# Altium project DC Switch Matrix.PrjPcb
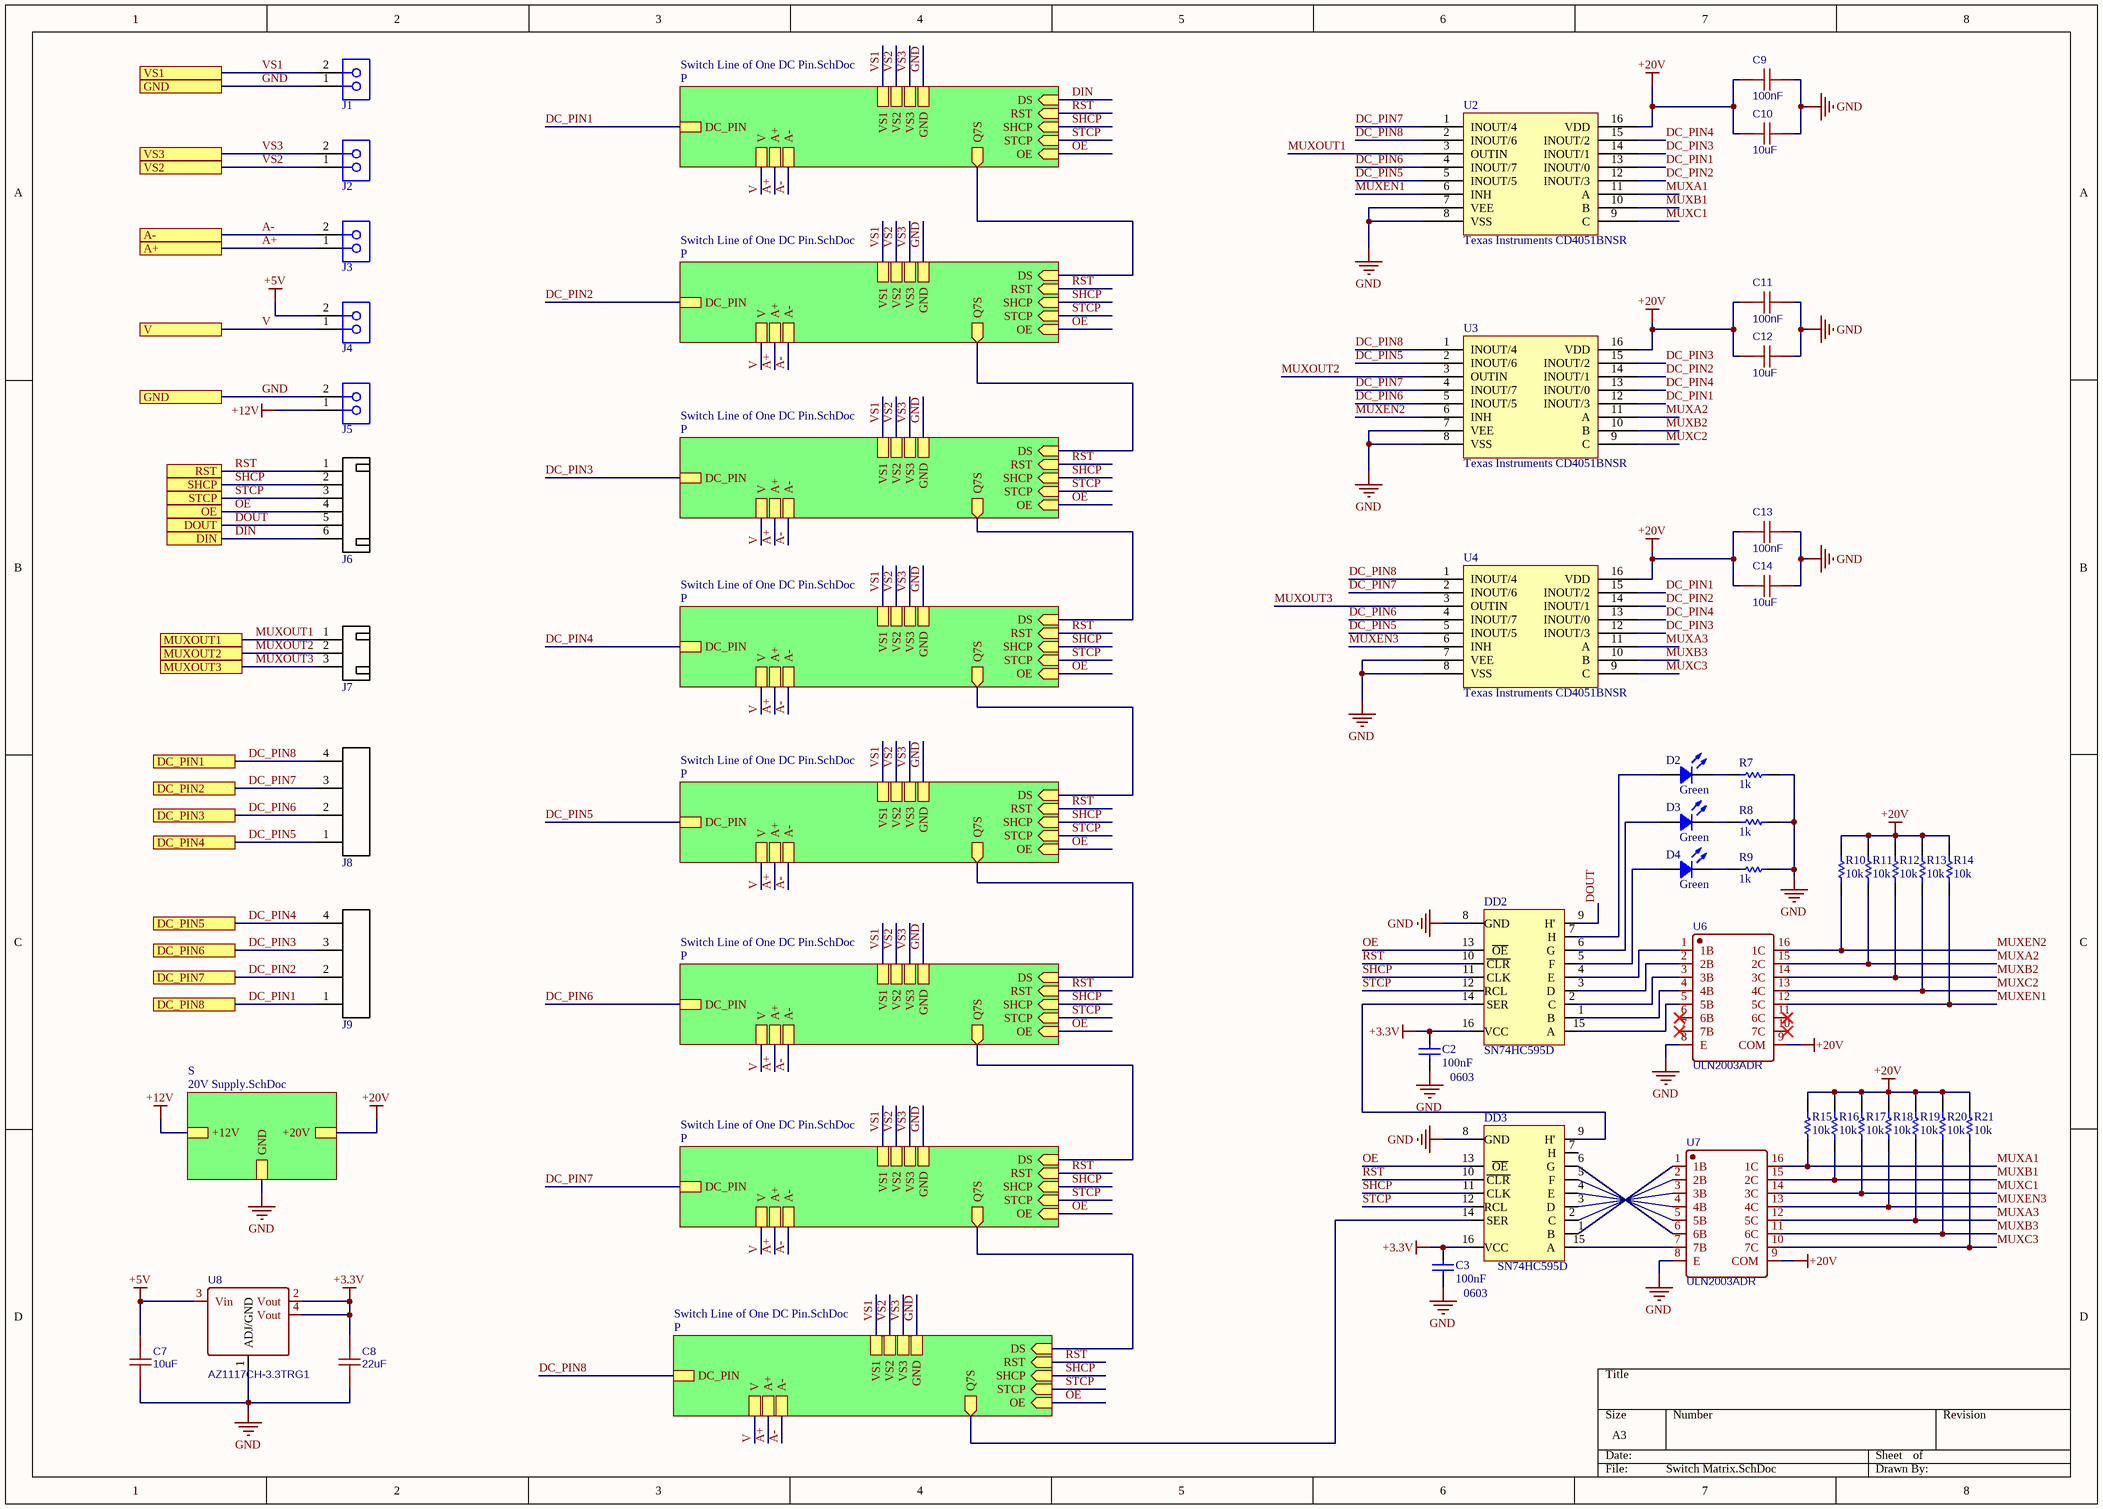
[diagram p0: Switch Matrix.SchDoc]
3 sheets, 174 parts. Net scope: hierarchical (ports join the sheet entries above them; power ports are global).
Board file: Switch Matrix PCB.PcbDoc
Sheets:
  Switch Matrix.SchDoc
    P = Switch Line of One DC Pin.SchDoc
    P = Switch Line of One DC Pin.SchDoc
    P = Switch Line of One DC Pin.SchDoc
    P = Switch Line of One DC Pin.SchDoc
    P = Switch Line of One DC Pin.SchDoc
    P = Switch Line of One DC Pin.SchDoc
    P = Switch Line of One DC Pin.SchDoc
    P = Switch Line of One DC Pin.SchDoc
    S = 20V Supply.SchDoc

## Sheet Switch Matrix.SchDoc
size A3

### Parts
C2  100nF  Package / Case: 0603  [CAPC1608X09N]
C3  100nF  Package / Case: 0603  [CAPC1608X09N]
C7  10uF  [C0805]
C8  22uF  [C0603]
C9  100nF  [C0603]
C10  10uF  [C0805]
C11  100nF  [C0603]
C12  10uF  [C0805]
C13  100nF  [C0603]
C14  10uF  [C0805]
D2  Green  [LED 0603_1608 GREEN]
D3  Green  [LED 0603_1608 GREEN]
D4  Green  [LED 0603_1608 GREEN]
DD2  SN74HC595D  [PCB-72k1vk0k27b6qyyenbg0-1]
DD3  SN74HC595D  [PCB-72k1vk0k27b6qyyenbg0-1]
J1  DB126V-5.0-2P-GN  [PCB-kiok1jlp9o9fcwf1wwvf-1]  (value not drawn)
J2  DB126V-5.0-2P-GN  [PCB-kiok1jlp9o9fcwf1wwvf-1]  (value not drawn)
J3  DB126V-5.0-2P-GN  [PCB-kiok1jlp9o9fcwf1wwvf-1]  (value not drawn)
J4  DB126V-5.0-2P-GN  [PCB-kiok1jlp9o9fcwf1wwvf-1]  (value not drawn)
J5  DB126V-5.0-2P-GN  [PCB-kiok1jlp9o9fcwf1wwvf-1]  (value not drawn)
J6  JST S6B-XH-A  [JST S6B-XH-A]  (value not drawn)
J7  CN-1P-M-R3  [JST-S3B-XH-A(LF)(SN)_V]  (value not drawn)
J8  JST B4PS-VH(LF)(SN)  [PCB-fv0n1qe7e7tw0owzte2c-1]  (value not drawn)
J9  JST B4PS-VH(LF)(SN)  [PCB-fv0n1qe7e7tw0owzte2c-1]  (value not drawn)
R7  1k  [gen0603-2]
R8  1k  [gen0603-2]
R9  1k  [gen0603-2]
R10  10k  [gen0603-2]
R11  10k  [gen0603-2]
R12  10k  [gen0603-2]
R13  10k  [gen0603-2]
R14  10k  [gen0603-2]
R15  10k  [gen0603-2]
R16  10k  [gen0603-2]
R17  10k  [gen0603-2]
R18  10k  [gen0603-2]
R19  10k  [gen0603-2]
R20  10k  [gen0603-2]
R21  10k  [gen0603-2]
U2  Texas Instruments CD4051BNSR  [PCB-xp4qbii5l2bbflfsgoli-1]
U3  Texas Instruments CD4051BNSR  [PCB-xp4qbii5l2bbflfsgoli-1]
U4  Texas Instruments CD4051BNSR  [PCB-xp4qbii5l2bbflfsgoli-1]
U6  ULN2003ADR  [SOIC-16_L9.9-W3.9-P1.27-LS6.0-BL]
U7  ULN2003ADR  [SOIC-16_L9.9-W3.9-P1.27-LS6.0-BL]
U8  AZ1117CH-3.3TRG1  [SOT-223-3_L6.5-W3.4-P2.30-LS7.0-BR]

### Sub-sheets
P = Switch Line of One DC Pin.SchDoc: DC_PIN, STCP (in), SHCP (in), Q7S (out), VS2, OE (in), VS1, RST (in), VS3, DS (in), GND, A+, A-, V
P = Switch Line of One DC Pin.SchDoc: DC_PIN, STCP (in), SHCP (in), Q7S (out), VS2, OE (in), VS1, RST (in), VS3, DS (in), GND, A+, A-, V
P = Switch Line of One DC Pin.SchDoc: DC_PIN, STCP (in), SHCP (in), Q7S (out), VS2, OE (in), VS1, RST (in), VS3, DS (in), GND, A+, A-, V
P = Switch Line of One DC Pin.SchDoc: DC_PIN, STCP (in), SHCP (in), Q7S (out), VS2, OE (in), VS1, RST (in), VS3, DS (in), GND, A+, A-, V
P = Switch Line of One DC Pin.SchDoc: DC_PIN, STCP (in), SHCP (in), Q7S (out), VS2, OE (in), VS1, RST (in), VS3, DS (in), GND, A+, A-, V
P = Switch Line of One DC Pin.SchDoc: DC_PIN, STCP (in), SHCP (in), Q7S (out), VS2, OE (in), VS1, RST (in), VS3, DS (in), GND, A+, A-, V
P = Switch Line of One DC Pin.SchDoc: DC_PIN, STCP (in), SHCP (in), Q7S (out), VS2, OE (in), VS1, RST (in), VS3, DS (in), GND, A+, A-, V
P = Switch Line of One DC Pin.SchDoc: DC_PIN, STCP (in), SHCP (in), Q7S (out), VS2, OE (in), VS1, RST (in), VS3, DS (in), GND, A+, A-, V
S = 20V Supply.SchDoc: +20V, +12V, GND

### Ports
A+, A-, DC_PIN1, DC_PIN2, DC_PIN3, DC_PIN4, DC_PIN5, DC_PIN6, DC_PIN7, DC_PIN8, DIN, DOUT, GND, MUXOUT1, MUXOUT2, MUXOUT3, OE, RST, SHCP, STCP, V, VS1, VS2, VS3

### Nets
+3.3V: C2.2 C3.2 C8.2 DD2.16(VCC) DD3.16(VCC) U8.2(Vout) U8.4(Vout)
+5V: C7.2 J4.2 U8.3(Vin)
+12V: J5.1 ; sheet S/+12V
+20V: C9.1 C10.2 C11.1 C12.2 C13.1 C14.2 R10.2 R11.2 R12.2 R13.2 R14.2 R15.2 R16.2 R17.2 R18.2 R19.2 R20.2 R21.2 U2.16(VDD) U3.16(VDD) U4.16(VDD) U6.9(COM) U7.9(COM) ; sheet S/+20V
GND: C2.1 C3.1 C7.1 C8.1 C9.2 C10.1 C11.2 C12.1 C13.2 C14.1 DD2.8(GND) DD3.8(GND) J1.1 J5.2 R7.1 R8.1 R9.1 U2.7(VEE) U2.8(VSS) U3.7(VEE) U3.8(VSS) U4.7(VEE) U4.8(VSS) U6.8(E) U7.8(E) U8.1(ADJ/GND) ; port GND, sheet P/GND, sheet P/GND, sheet P/GND, sheet P/GND, sheet P/GND, sheet P/GND, sheet P/GND, sheet P/GND, sheet S/GND
A+: J3.1 ; port A+, sheet P/A+, sheet P/A+, sheet P/A+, sheet P/A+, sheet P/A+, sheet P/A+, sheet P/A+, sheet P/A+
A-: J3.2 ; port A-, sheet P/A-, sheet P/A-, sheet P/A-, sheet P/A-, sheet P/A-, sheet P/A-, sheet P/A-, sheet P/A-
DC_PIN1: J9.1 U2.13(INOUT/0) U3.12(INOUT/3) U4.15(INOUT/2) ; port DC_PIN8, sheet P/DC_PIN
DC_PIN2: J9.2 U2.12(INOUT/3) U3.14(INOUT/1) U4.14(INOUT/1) ; port DC_PIN7, sheet P/DC_PIN
DC_PIN3: J9.3 U2.14(INOUT/1) U3.15(INOUT/2) U4.12(INOUT/3) ; port DC_PIN6, sheet P/DC_PIN
DC_PIN4: J9.4 U2.15(INOUT/2) U3.13(INOUT/0) U4.13(INOUT/0) ; port DC_PIN5, sheet P/DC_PIN
DC_PIN5: J8.1 U2.5(INOUT/5) U3.2(INOUT/6) U4.5(INOUT/5) ; port DC_PIN4, sheet P/DC_PIN
DC_PIN6: J8.2 U2.4(INOUT/7) U3.5(INOUT/5) U4.4(INOUT/7) ; port DC_PIN3, sheet P/DC_PIN
DC_PIN7: J8.3 U2.1(INOUT/4) U3.4(INOUT/7) U4.2(INOUT/6) ; port DC_PIN2, sheet P/DC_PIN
DC_PIN8: J8.4 U2.2(INOUT/6) U3.1(INOUT/4) U4.1(INOUT/4) ; port DC_PIN1, sheet P/DC_PIN
DIN: J6.6 ; port DIN, sheet P/DS
DOUT: DD2.9(H') J6.5 ; port DOUT
MUXA1: R15.1 U2.11(A) U7.16(1C)
MUXA2: R11.1 U3.11(A) U6.15(2C)
MUXA3: R19.1 U4.11(A) U7.12(5C)
MUXB1: R16.1 U2.10(B) U7.15(2C)
MUXB2: R12.1 U3.10(B) U6.14(3C)
MUXB3: R20.1 U4.10(B) U7.11(6C)
MUXC1: R17.1 U2.9(C) U7.14(3C)
MUXC2: R13.1 U3.9(C) U6.13(4C)
MUXC3: R21.1 U4.9(C) U7.10(7C)
MUXEN1: R14.1 U2.6(INH) U6.12(5C)
MUXEN2: R10.1 U3.6(INH) U6.16(1C)
MUXEN3: R18.1 U4.6(INH) U7.13(4C)
MUXOUT1: J7.1 U2.3(OUTIN) ; port MUXOUT1
MUXOUT2: J7.2 U3.3(OUTIN) ; port MUXOUT2
MUXOUT3: J7.3 U4.3(OUTIN) ; port MUXOUT3
OE: DD2.13(~{OE}) DD3.13(~{OE}) J6.4 ; port OE, sheet P/OE, sheet P/OE, sheet P/OE, sheet P/OE, sheet P/OE, sheet P/OE, sheet P/OE, sheet P/OE
RST: DD2.10(~{CLR}) DD3.10(~{CLR}) J6.1 ; port RST, sheet P/RST, sheet P/RST, sheet P/RST, sheet P/RST, sheet P/RST, sheet P/RST, sheet P/RST, sheet P/RST
SHCP: DD2.11(CLK) DD3.11(CLK) J6.2 ; port SHCP, sheet P/SHCP, sheet P/SHCP, sheet P/SHCP, sheet P/SHCP, sheet P/SHCP, sheet P/SHCP, sheet P/SHCP, sheet P/SHCP
STCP: DD2.12(RCL) DD3.12(RCL) J6.3 ; port STCP, sheet P/STCP, sheet P/STCP, sheet P/STCP, sheet P/STCP, sheet P/STCP, sheet P/STCP, sheet P/STCP, sheet P/STCP
V: J4.1 ; port V, sheet P/V, sheet P/V, sheet P/V, sheet P/V, sheet P/V, sheet P/V, sheet P/V, sheet P/V
VS1: J1.2 ; port VS1, sheet P/VS1, sheet P/VS1, sheet P/VS1, sheet P/VS1, sheet P/VS1, sheet P/VS1, sheet P/VS1, sheet P/VS1
VS2: J2.1 ; port VS2, sheet P/VS2, sheet P/VS2, sheet P/VS2, sheet P/VS2, sheet P/VS2, sheet P/VS2, sheet P/VS2, sheet P/VS2
VS3: J2.2 ; port VS3, sheet P/VS3, sheet P/VS3, sheet P/VS3, sheet P/VS3, sheet P/VS3, sheet P/VS3, sheet P/VS3, sheet P/VS3
NetD2_1: D2.1 DD2.7(H)
NetD2_2: D2.2 R7.2
NetD3_1: D3.1 DD2.6(G)
NetD3_2: D3.2 R8.2
NetD4_1: D4.1 DD2.5(F)
NetD4_2: D4.2 R9.2
NetDD1_P1_9: sheet P/DS, sheet P/Q7S
NetDD1_P2_9: sheet P/DS, sheet P/Q7S
NetDD1_P3_9: sheet P/DS, sheet P/Q7S
NetDD1_P4_9: sheet P/DS, sheet P/Q7S
NetDD1_P5_9: sheet P/DS, sheet P/Q7S
NetDD1_P6_9: sheet P/DS, sheet P/Q7S
NetDD1_P7_9: sheet P/DS, sheet P/Q7S
NetDD1_P8_9: DD3.14(SER) ; sheet P/Q7S
NetDD2_1: DD2.1(B) U6.4(4B)
NetDD2_2: DD2.2(C) U6.3(3B)
NetDD2_3: DD2.3(D) U6.2(2B)
NetDD2_4: DD2.4(E) U6.1(1B)
NetDD2_14: DD2.14(SER) DD3.9(H')
NetDD2_15: DD2.15(A) U6.5(5B)
NetDD3_1: DD3.1(B) U7.1(1B)
NetDD3_2: DD3.2(C) U7.2(2B)
NetDD3_3: DD3.3(D) U7.3(3B)
NetDD3_4: DD3.4(E) U7.4(4B)
NetDD3_5: DD3.5(F) U7.5(5B)
NetDD3_6: DD3.6(G) U7.6(6B)
NetDD3_15: DD3.15(A) U7.7(7B)

Not connected (* = marked no-connect by the designer): DD3 7(H); U6 6(6B)* 7(7B)* 10(7C)* 11(6C)*

### Library data of the parts
C2 C3 = CMP-2f55e5122ad9f092-5: 0603 10 nF 50 V ± 10% Tolerance X7R Surface Mount Multilayer Ceramic Capacitor; Manufacture Part Number: CC0603KRX7R9BB104; Manufacturer: YAGEO; Voltage-Rated: 50V; Capacitance Tolerance: 10%; Capacitance: 100nF; Supplier: LCSC; Supplier Part Number: C14663
C7 C10 C12 C14 = 10uF: Manufacture Part Number: CL21B106KOQNNNE; Manufacturer: SAMSUNG; nameAlias: Capacitance; spicePre: C; spiceSymbolName: CL21B106KOQNNNE; Supplier: LCSC; Supplier Part Number: C95841
C8 = 22uF: Manufacture Part Number: CL10A226MP8NUNE; Manufacturer: SAMSUNG; nameAlias: Capacitance; SMT Type: Extend; BOM_LCSC Assembly: Yes; spicePre: C; spiceSymbolName: CL10A226MP8NUNE; Supplier: LCSC; Supplier Part Number: C86295
C9 C11 C13 = 100nF: Manufacture Part Number: CC0603KRX7R9BB104; Manufacturer: YAGEO; nameAlias: Capacitance; SMT Type: Basic; BOM_LCSC Assembly: Yes; spicePre: C; spiceSymbolName: CC0603KRX7R9BB104; Supplier: LCSC; Supplier Part Number: C14663
D2-D4 = TLMG1100-GS08: LED GREEN 0603 SMD; Manufacturer: Orient; Manufacture Part Number: ORH-G36G; Forward Voltage: 2.8V; Color: Green; ComponentLink1Description: Datasheet; ComponentLink1URL: http://www.vishay.com/docs/83173/tlmb1100.pdf; ComponentLink2Description: DigiKey Link; ComponentLink2URL: http://digikey.com/product-detail/en/vishay-semiconductor-opto-division/TLMG1100-GS08/751-1165-1-ND/1681448; Supplier: LCSC; Supplier Part Number: C205443
DD2 DD3 = CMP-ded317d957220114-5: Shift Register Single 8-Bit Serial to Serial/Parallel 16-Pin SOIC Tube; Manufacture Part Number: 74HC595D,118; Manufacturer: Nexperia; Supplier: LCSC; Supplier Part Number: C5947; Package / Case: SOIC-16_150mil
J1-J5 = CMP-7ad9b3d37ed8a51e-5: Block, Terminal; 13.5 A; 250 V; 5 mm; 26 to 16 AWG; 2; Screw; Solder; 4 kV; PA; Manufacturer: DIBO; Pin pitch: 5.0mm; Manufacture Part Number: DB126V-5.0-2P-GN; Supplier: LCSC; Supplier Part Number: C395849
J6 = CMP-239aeae271c2fc5d-12: Socket; wire-board; male; PIN: 6; 2.5mm; THT; XH; 250V; 3A; -25÷85°C; Manufacturer: JST Sales America; Manufacture Part Number: S6B-XH-A(LF)(SN); Lead-Free Status: Lead Free; Voltage Rating (AC): 250 V; Orientation: Right Angle; Supplier: LCSC; Supplier Part Number: C157919
J7 = CMP-656568-19: Male Header, Pitch 2.5 mm, 1 x 3 Position, Height 6.1 mm, Tail Length 3.4 mm, -25 to 85 degC, RoHS, Bulk; Manufacture Part Number: S3B-XH-A(LF)(SN); Manufacturer: JST Sales America; Number of Contacts: 3; Current Rating: 3.00 A; Lead-Free Status: Lead Free; Insulation Resistance: 1.00 GΩ; RoHS: Compliant; PackageDescription: Male Header, Pitch 2.5 mm, 1 x 3 Position, Height 6.1 mm, Tail Length 3.4 mm; Gender: Male; Mounting Style: Through Hole; PackageReference: S3B-XH-A(LF)(SN); Supplier Part Number: C157928; Supplier: LCSC
J8 J9 = CMP-324efb47dcc6ed89-6: Connector Header, VH Series, 4 Position, 3.96mm, 250V, 22-16 AWG, Side Entry, Natural; Manufacture Part Number: B8PS-VH(LF)(SN); Manufacturer: JST Sales America; Current Rating: 7.00 A; Pin Pitch: 3.96 mm; Supplier: LCSC; Supplier Part Number: C157970
R7-R9 = CMP-1853278-27: Manufacture Part Number: RC0603FR-071KL; Manufacturer: YAGEO; Resistance Tolerance: 1%; Supplier: LCSC; Supplier Part Number: C22548; Resistance: 1k; Package / Case: 0603
R10-R21 = CMP-1853278-27: Manufacture Part Number: RC0603FR-0710KL; Manufacturer: YAGEO; Resistance Tolerance: 1%; Supplier: LCSC; Supplier Part Number: C98220; Resistance: 10k; Package / Case: 0603
U2-U4 = CMP-7a8fb3826b5da548-1: 20-V, 8: 1, 1-channel analog multiplexer with logic-level conversion 16-SO -55 to 125; Bandwidth: 20.0 MHz; Lead-Free Status: Lead Free; Number of Bits: 8; Number of Circuits: 1; Polarity: Non-Inverting; Propagation Delay Max (tpd): 20.0 ns; Quiescent Current: 80.0 nA; Supply Current: 100 µA; Supply Voltage (DC): 15.0 V; Voltage Nodes: 10.0 V, 5.00 V, 15.0 V; Octopart URL: https://octopart.com/cd4051bnsr-texas+instruments-472244; Case/Package: PDIP, SOIC, SOP; Lifecycle Status: Active; Mounting Style: Surface Mount; Number of Channels: 8; Operating Temperature: -55.0 °C to 125 °C; Packaging: SOIC-16_208mil; Number of Pins: 16; RoHS: Compliant; OctopartID: 7a8fb3826b5da548; Supplier Part Number: C87646; Supplier: LCSC; Manufacture Part Number: CD4051BNSR; Manufacturer: Texas Instruments
U6 U7 = ULN2003ADR: Manufacturer: TI; SMT Type: Basic; spicePre: X; image: //image.lceda.cn/szlcsc/C7512.jpg; BOM_LCSC Assembly: Yes; spiceSymbolName: ULN2003ADR; Manufacture Part Number: ULN2003ADR; Supplier: LCSC; Supplier Part Number: C7512
U8 = AZ1117CH-3.3TRG1: Manufacturer: DIODES; SMT Type: Extend; BOM_LCSC Assembly: Yes; spicePre: U; spiceSymbolName: AZ1117CH-3.3TRG1; Manufacture Part Number: AZ1117CH-3.3TRG1; Supplier: LCSC; Supplier Part Number: C92102

## Sheet Switch Line of One DC Pin.SchDoc
size A3
Used 8 times, as channels P, P, P, P, P, P, P, P. Parts and nets are listed once, with the designators drawn on the sheet.
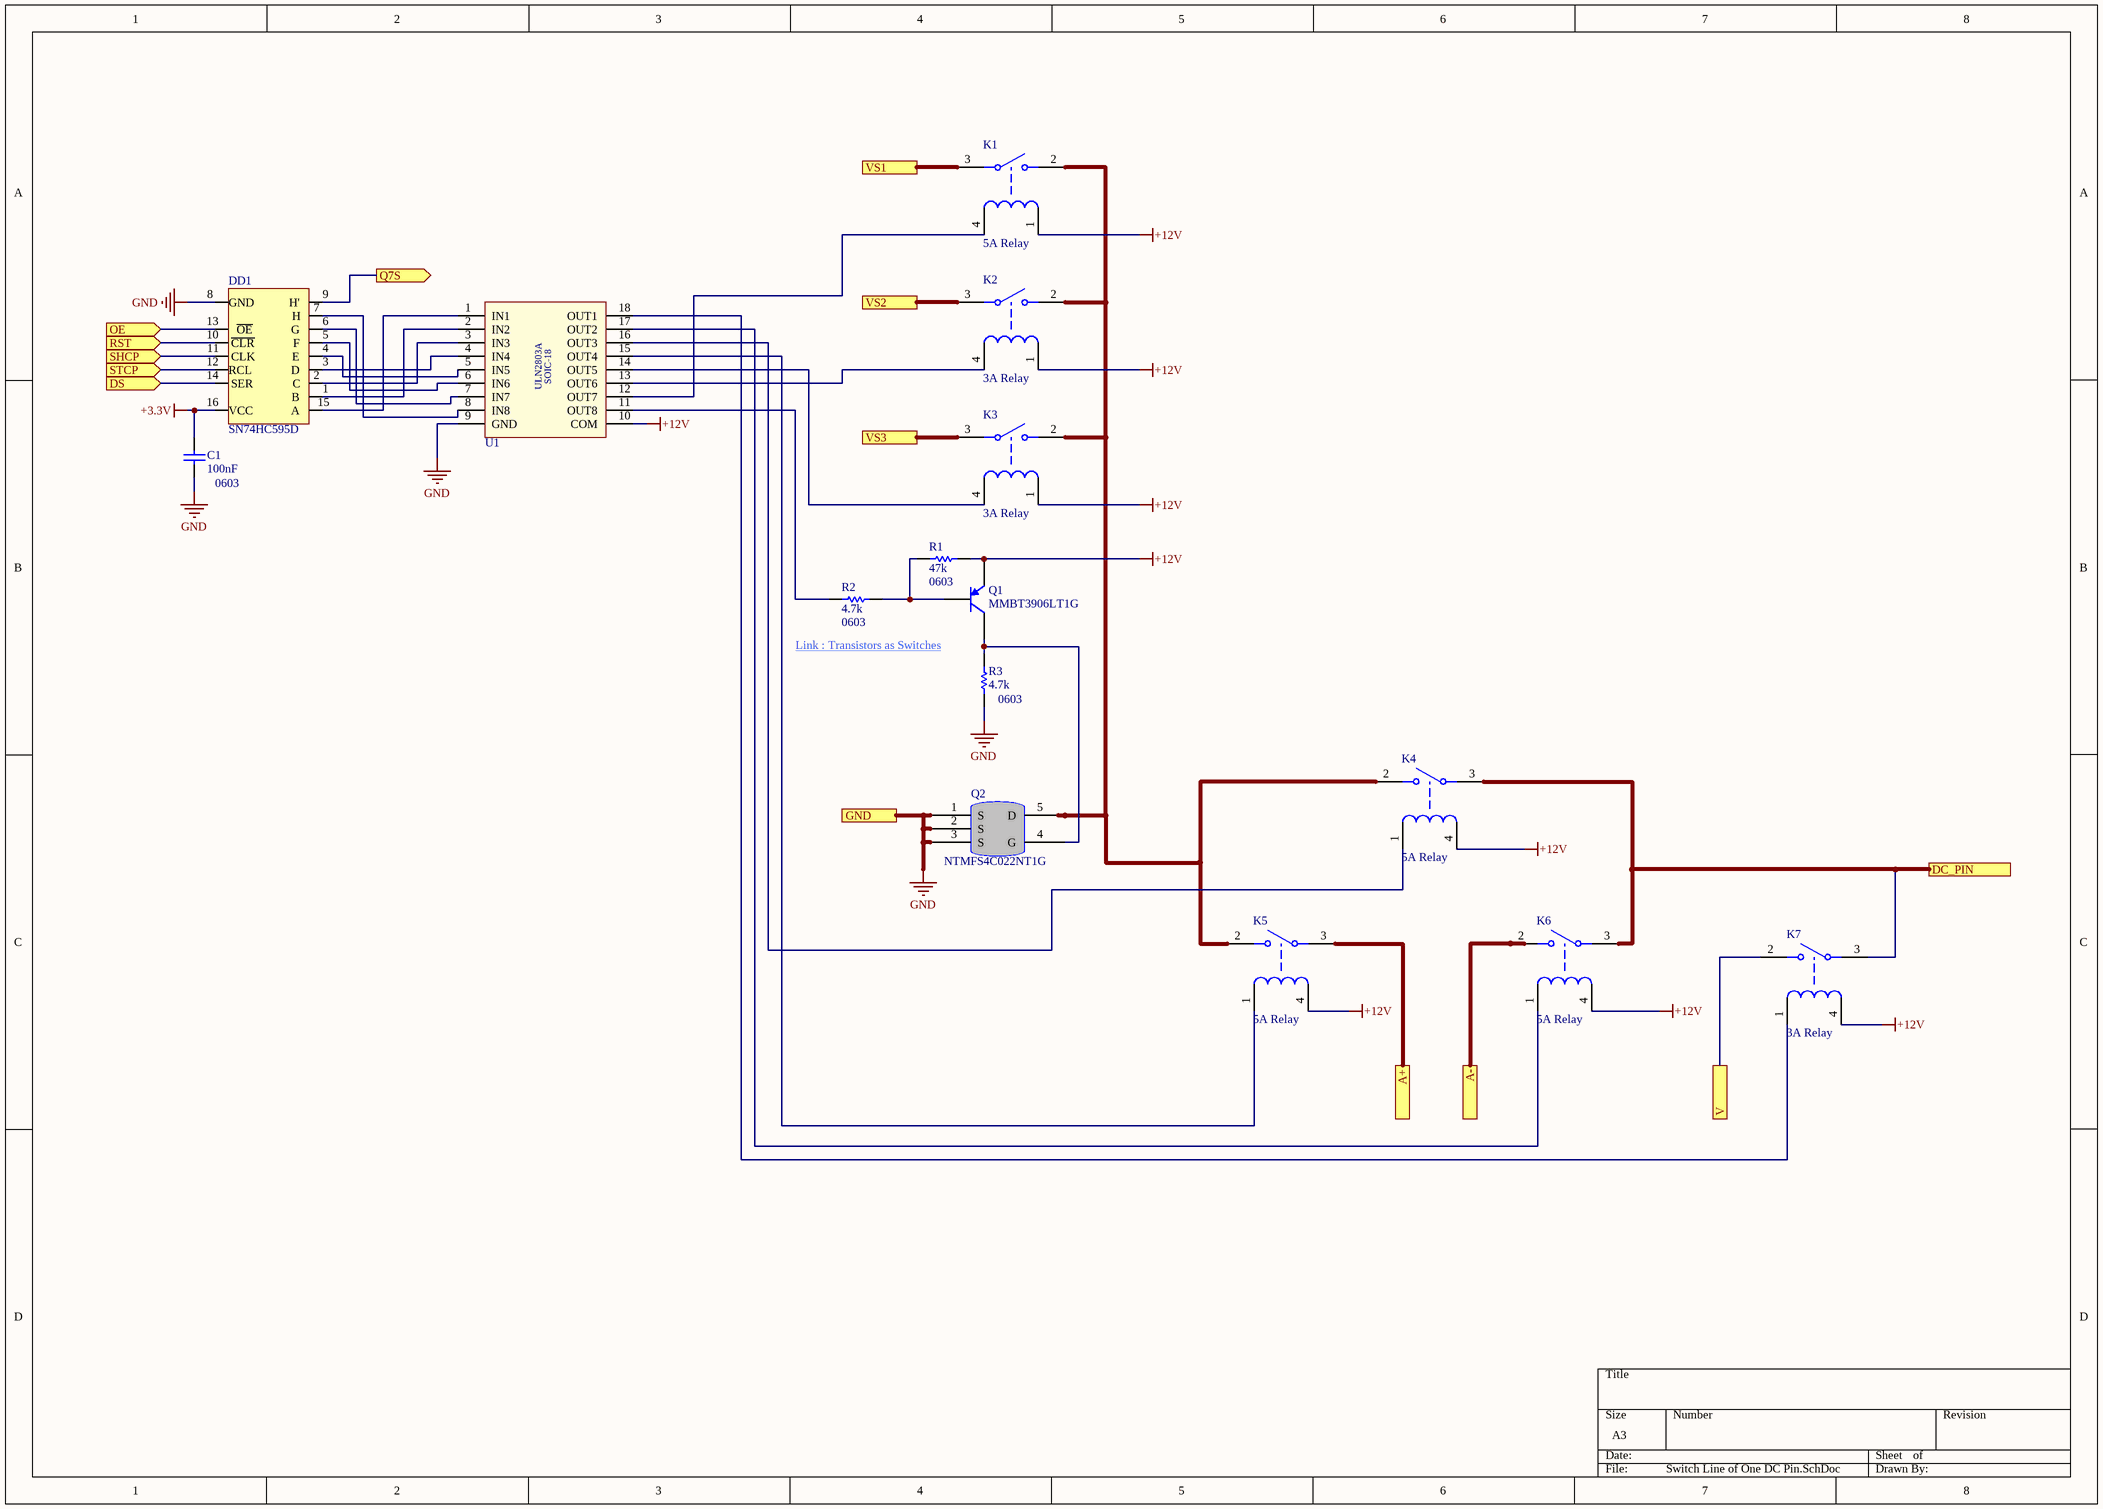
[diagram p1: Switch Line of One DC Pin.SchDoc]

### Parts
C1  100nF  Package / Case: 0603  [CAPC1608X09N]
DD1  SN74HC595D  [PCB-72k1vk0k27b6qyyenbg0-1]
K1  5A Relay  [PCB-ei6nokn2irsc2a7yt94x-1]
K2  3A Relay  [PCB-ei6nokn2irsc2a7yt94x-1]
K3  3A Relay  [PCB-ei6nokn2irsc2a7yt94x-1]
K4  5A Relay  [PCB-ei6nokn2irsc2a7yt94x-1]
K5  5A Relay  [PCB-ei6nokn2irsc2a7yt94x-1]
K6  5A Relay  [PCB-ei6nokn2irsc2a7yt94x-1]
K7  3A Relay  [PCB-ei6nokn2irsc2a7yt94x-1]
Q1  MMBT3906LT1G  [SOT-23]
Q2  NTMFS4C022NT1G  [PCB-iok221h7g3hg093tnixb-1]
R1  47k  Package / Case: 0603  [gen0603-2]
R2  4.7k  Package / Case: 0603  [gen0603-2]
R3  4.7k  Package / Case: 0603  [gen0603-2]
U1  ULN2803A (SOIC-18)  [PCB-gcdku7p92m9mz9ih2yin-1]  (value not drawn)

### Ports
A+, A-, DC_PIN, DS (in), GND, OE (in), Q7S (out), RST (in), SHCP (in), STCP (in), V, VS1, VS2, VS3

### Nets
+3.3V: C1.2 DD1.16(VCC)
+12V: K1.1 K2.1 K3.1 K4.4 K5.4 K6.4 K7.4 Q1.2(E) R1.1 U1.10(COM)
GND: C1.1 DD1.8(GND) Q2.1(S) Q2.2(S) Q2.3(S) R3.1 U1.9(GND) ; port GND
A+: K5.3 ; port A+
A-: K6.2 ; port A-
DC_PIN: K4.3 K6.3 K7.3 ; port DC_PIN
DS: DD1.14(SER) ; port DS
OE: DD1.13(~{OE}) ; port OE
Q7S: DD1.9(H') ; port Q7S
RST: DD1.10(~{CLR}) ; port RST
SHCP: DD1.11(CLK) ; port SHCP
STCP: DD1.12(RCL) ; port STCP
V: K7.2 ; port V
VS1: K1.3 ; port VS1
VS2: K2.3 ; port VS2
VS3: K3.3 ; port VS3
NetDD1_1: DD1.1(B) U1.2(IN2)
NetDD1_2: DD1.2(C) U1.3(IN3)
NetDD1_3: DD1.3(D) U1.4(IN4)
NetDD1_4: DD1.4(E) U1.5(IN5)
NetDD1_5: DD1.5(F) U1.6(IN6)
NetDD1_6: DD1.6(G) U1.7(IN7)
NetDD1_7: DD1.7(H) U1.8(IN8)
NetDD1_15: DD1.15(A) U1.1(IN1)
NetK1_2: K1.2 K2.2 K3.2 K4.2 K5.2 Q2.5(D)
NetK1_4: K1.4 U1.12(OUT7)
NetK2_4: K2.4 U1.13(OUT6)
NetK3_4: K3.4 U1.14(OUT5)
NetK4_1: K4.1 U1.16(OUT3)
NetK5_1: K5.1 U1.15(OUT4)
NetK6_1: K6.1 U1.17(OUT2)
NetK7_1: K7.1 U1.18(OUT1)
NetQ1_1: Q1.1(B) R1.2 R2.1
NetQ1_3: Q1.3(C) Q2.4(G) R3.2
NetR2_2: R2.2 U1.11(OUT8)

### Channels
P: designators end in _P8; ports A+=A+ A-=A- DC_PIN=DC_PIN8 DS=NetDD1_P7_9 GND=GND OE=OE Q7S=NetDD1_P8_9 RST=RST SHCP=SHCP STCP=STCP V=V VS1=VS1 VS2=VS2 VS3=VS3
P: designators end in _P7; ports A+=A+ A-=A- DC_PIN=DC_PIN7 DS=NetDD1_P6_9 GND=GND OE=OE Q7S=NetDD1_P7_9 RST=RST SHCP=SHCP STCP=STCP V=V VS1=VS1 VS2=VS2 VS3=VS3
P: designators end in _P6; ports A+=A+ A-=A- DC_PIN=DC_PIN6 DS=NetDD1_P5_9 GND=GND OE=OE Q7S=NetDD1_P6_9 RST=RST SHCP=SHCP STCP=STCP V=V VS1=VS1 VS2=VS2 VS3=VS3
P: designators end in _P5; ports A+=A+ A-=A- DC_PIN=DC_PIN5 DS=NetDD1_P4_9 GND=GND OE=OE Q7S=NetDD1_P5_9 RST=RST SHCP=SHCP STCP=STCP V=V VS1=VS1 VS2=VS2 VS3=VS3
P: designators end in _P4; ports A+=A+ A-=A- DC_PIN=DC_PIN4 DS=NetDD1_P3_9 GND=GND OE=OE Q7S=NetDD1_P4_9 RST=RST SHCP=SHCP STCP=STCP V=V VS1=VS1 VS2=VS2 VS3=VS3
P: designators end in _P3; ports A+=A+ A-=A- DC_PIN=DC_PIN3 DS=NetDD1_P2_9 GND=GND OE=OE Q7S=NetDD1_P3_9 RST=RST SHCP=SHCP STCP=STCP V=V VS1=VS1 VS2=VS2 VS3=VS3
P: designators end in _P2; ports A+=A+ A-=A- DC_PIN=DC_PIN2 DS=NetDD1_P1_9 GND=GND OE=OE Q7S=NetDD1_P2_9 RST=RST SHCP=SHCP STCP=STCP V=V VS1=VS1 VS2=VS2 VS3=VS3
P: designators end in _P1; ports A+=A+ A-=A- DC_PIN=DC_PIN1 DS=DIN GND=GND OE=OE Q7S=NetDD1_P1_9 RST=RST SHCP=SHCP STCP=STCP V=V VS1=VS1 VS2=VS2 VS3=VS3

### Notes on the sheet
- (near R3) Link : Transistors as Switches <https://pe2bz.philpem.me.uk/Power/-%20Pulse/Info-UsingBipolarTransistors-as-Switches/transwit.htm>
- (in symbol CMP-19353911-22) SOIC-18

### Library data of the parts
C1 = CMP-2f55e5122ad9f092-5: as C2 on sheet Switch Matrix; Capacitance Tolerance: 10%; Capacitance: 100nF; Supplier: LCSC; Supplier Part Number: C14663
DD1 = CMP-ded317d957220114-5: as DD2 on sheet Switch Matrix; Supplier: LCSC; Supplier Part Number: C5947; Package / Case: SOIC-16_150mil
K1 K4-K6 = CMP-edc624afa9603201-3: General Purpose Non Latching 12VDC SPST-NO 5A Through Hole Relays RoHS; Manufacturer: HF(Xiamen Hongfa Electroacoustic); Manufacture Part Number: HF46F/12-HS1; Supplier: LCSC; Supplier Part Number: C3636; Current-Rated: 5A
K2 K3 K7 = CMP-edc624afa9603201-3: Power Relay 12VDC 3DC/5AAC SPST-NO( (20.5mm 7.2mm 15.3mm)) THT; Manufacturer: Omron Electronics; Manufacture Part Number: G5NB-1A-E-DC12; Supplier: LCSC; Supplier Part Number: C225714; Current-Rated: 3A
Q1 = CMP-857798-9: Bipolar (BJT) Single Transistor, General Purpose, PNP, -40 V, 250 MHz, 225 mW, -200 mA, 300; Manufacturer: ON Semiconductor; Voltage Rating (DC): -40.0 V; Current Rating: -200 mA; Polarity: PNP; RoHS: Compliant; Mounting Style: Surface Mount; Lifecycle Status: Active; REACH SVHC Compliance: No SVHC; Supplier: LCSC; Supplier Part Number: C53444; OctopartID: 79f4b3b314a6a633; Breakdown Voltage [Collector to Emitter]: -40.0 V; Manufacture Part Number: MMBT3906LT1G; Package / Case: SOT-23
Q2 = CMP-42ac8f2778579d6b-1: Power MOSFET 30V 136A 1.7 mOhm Single N?Channel SO?8FL; Manufacturer: ON Semiconductor; Lead-Free Status: Lead Free; Octopart URL: https://octopart.com/ntmfs4c022nt1g-on+semiconductor-75571101; Lifecycle Status: Active; RoHS: Compliant; OctopartID: 42ac8f2778579d6b; Manufacture Part Number: NTMFS4C022NT1G; Supplier: LCSC; Supplier Part Number: C179623
R1 = CMP-1853278-27: Surface Mount Thick Film Resistor, RC Series, 1 kohm, 100 mW, - 1%, 50 V, 0603 [1608 Metric]; Manufacturer: UNI-ROYAL(Uniroyal Elec); Manufacture Part Number: 0603WAF4702T5E; Resistance Tolerance: 1%; Supplier: LCSC; Supplier Part Number: C25819; Resistance: 47k; Resistance Tolarance: *
R2 R3 = CMP-1853278-27: Surface Mount Thick Film Resistor, RC Series, 1 kohm, 100 mW, - 1%, 50 V, 0603 [1608 Metric]; Manufacturer: YAGEO; Manufacture Part Number: RC0603FR-074K7L; Resistance Tolerance: 1%; Supplier: LCSC; Supplier Part Number: C99782; Resistance: 4.7k
  R2: Resistance Tolarance: *
U1 = CMP-19353911-22: Bipolar (BJT) Array Transistor, Darlington, NPN, 50 V, 500 mA, SOIC; Manufacturer: Mixic; Manufacture Part Number: ULN2803A; Supplier: LCSC; Supplier Part Number: C107219; Package / Case: SOP-18_300mil

## Sheet 20V Supply.SchDoc
size A
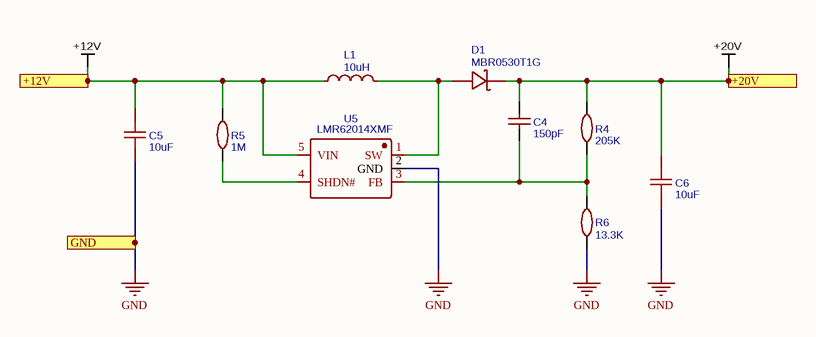
[diagram p2: 20V Supply.SchDoc]

### Parts
C4  150pF  [C0805]
C5  10uF  [C0805]
C6  10uF  [C0805]
D1  MBR0530T1G  [SOD-123_L2.8-W1.8-LS3.7-RD]
L1  10uH  [IND-SMD_L6.0-W6.0]
R4  205K  [R0603]
R5  1M  [R0603]
R6  13.3K  [R0603]
U5  LMR62014XMF  [SOT-23-5_L3.0-W1.7-P0.95-LS2.8-BR]

### Ports
+12V, +20V, GND

### Nets
+12V: C5.2 L1.1 R5.2 U5.5(VIN) ; port +12V
+20V: C4.2 C6.2 D1.1(C) R4.2 ; port +20V
GND: C5.1 C6.1 R6.1 U5.2(GND) ; port GND
NetC4_1: C4.1 R4.1 R6.2 U5.3(FB)
NetD1_2: D1.2(A) L1.2 U5.1(SW)
NetR5_1: R5.1 U5.4(SHDN#)

### Library data of the parts
C4 = 150pF: Manufacturer: YAGEO; Manufacture Part Number: CC0805JRNPO9BN151; nameAlias: Capacitance; Supplier: LCSC; Supplier Part Number: C107111; spicePre: C; spiceSymbolName: CC0805JRNPO9BN151
C5 C6 = 10uF: Manufacturer: SAMSUNG; Manufacture Part Number: CL21B106KOQNNNE; nameAlias: Capacitance; Supplier: LCSC; Supplier Part Number: C95841; spicePre: C; spiceSymbolName: CL21B106KOQNNNE
D1 = MBR0530T1G: Manufacturer: ON; SMT Type: Extend; Supplier: LCSC; Manufacture Part Number: MBR0530T1G; image: //image.lceda.cn/szlcsc/C82046.jpg; Supplier Part Number: C82046; BOM_LCSC Assembly: Yes; spicePre: D; spiceSymbolName: MBR0530T1G
L1 = 10uH: Manufacturer: TDK; Manufacture Part Number: VLS6045EX-100M; nameAlias: Inductance; Contributor: LCSC; Supplier: LCSC; Supplier Part Number: C360734; spicePre: L; spiceSymbolName: VLS6045EX-100M
R4 = 205K: Manufacturer: UniOhm; Manufacture Part Number: 0603WAF2053T5E; nameAlias: Resistance (Ohms); SMT Type: Extend; Supplier: LCSC; Supplier Part Number: C22949; BOM_LCSC Assembly: Yes; spicePre: R; spiceSymbolName: 0603WAF2053T5E
R5 = 1M: Manufacturer: UniOhm; Manufacture Part Number: 0603WAF1004T5E; nameAlias: Resistance (Ohms); SMT Type: Basic; Supplier: LCSC; BOM_LCSC Assembly: Yes; Supplier Part Number: C22935; spicePre: R; spiceSymbolName: 0603WAF1004T5E
R6 = 13.3K: Manufacturer: UniOhm; Manufacture Part Number: 0603WAF1332T5E; nameAlias: Resistance (Ohms); SMT Type: Extend; Supplier: LCSC; Supplier Part Number: C25952; BOM_LCSC Assembly: Yes; spicePre: R; spiceSymbolName: 0603WAF1332T5E
U5 = LMR62014XMF: Manufacturer: TI; SMT Type: Extend; Supplier: LCSC; Manufacture Part Number: LMR62014XMF; Supplier Part Number: C55182; BOM_LCSC Assembly: Yes; spicePre: U; spiceSymbolName: LMR62014XMF

## Nets that join several sheets
+3.3V: Switch Matrix (7 pins), P (C1_P8.2 DD1_P8.16), P (C1_P7.2 DD1_P7.16), P (C1_P6.2 DD1_P6.16), P (C1_P5.2 DD1_P5.16), P (C1_P4.2 DD1_P4.16), P (C1_P3.2 DD1_P3.16), P (C1_P2.2 DD1_P2.16), P (C1_P1.2 DD1_P1.16)
+12V: Switch Matrix (J5.1), P (10 pins), P (10 pins), P (10 pins), P (10 pins), P (10 pins), P (10 pins), P (10 pins), P (10 pins), 20V Supply (C5.2 L1.1 R5.2 U5.5)
+20V: Switch Matrix (23 pins), 20V Supply (C4.2 C6.2 D1.1 R4.2)
GND: Switch Matrix (26 pins), P (7 pins), P (7 pins), P (7 pins), P (7 pins), P (7 pins), P (7 pins), P (7 pins), P (7 pins), 20V Supply (C5.1 C6.1 R6.1 U5.2)
A+: Switch Matrix (J3.1), P (K5_P8.3), P (K5_P7.3), P (K5_P6.3), P (K5_P5.3), P (K5_P4.3), P (K5_P3.3), P (K5_P2.3), P (K5_P1.3)
A-: Switch Matrix (J3.2), P (K6_P8.2), P (K6_P7.2), P (K6_P6.2), P (K6_P5.2), P (K6_P4.2), P (K6_P3.2), P (K6_P2.2), P (K6_P1.2)
DC_PIN1: Switch Matrix (J9.1 U2.13 U3.12 U4.15), P (K4_P1.3 K6_P1.3 K7_P1.3)
DC_PIN2: Switch Matrix (J9.2 U2.12 U3.14 U4.14), P (K4_P2.3 K6_P2.3 K7_P2.3)
DC_PIN3: Switch Matrix (J9.3 U2.14 U3.15 U4.12), P (K4_P3.3 K6_P3.3 K7_P3.3)
DC_PIN4: Switch Matrix (J9.4 U2.15 U3.13 U4.13), P (K4_P4.3 K6_P4.3 K7_P4.3)
DC_PIN5: Switch Matrix (J8.1 U2.5 U3.2 U4.5), P (K4_P5.3 K6_P5.3 K7_P5.3)
DC_PIN6: Switch Matrix (J8.2 U2.4 U3.5 U4.4), P (K4_P6.3 K6_P6.3 K7_P6.3)
DC_PIN7: Switch Matrix (J8.3 U2.1 U3.4 U4.2), P (K4_P7.3 K6_P7.3 K7_P7.3)
DC_PIN8: Switch Matrix (J8.4 U2.2 U3.1 U4.1), P (K4_P8.3 K6_P8.3 K7_P8.3)
DIN: Switch Matrix (J6.6), P (DD1_P1.14)
NetDD1_P1_9: P (DD1_P2.14), P (DD1_P1.9)
NetDD1_P2_9: P (DD1_P3.14), P (DD1_P2.9)
NetDD1_P3_9: P (DD1_P4.14), P (DD1_P3.9)
NetDD1_P4_9: P (DD1_P5.14), P (DD1_P4.9)
NetDD1_P5_9: P (DD1_P6.14), P (DD1_P5.9)
NetDD1_P6_9: P (DD1_P7.14), P (DD1_P6.9)
NetDD1_P7_9: P (DD1_P8.14), P (DD1_P7.9)
NetDD1_P8_9: Switch Matrix (DD3.14), P (DD1_P8.9)
OE: Switch Matrix (DD2.13 DD3.13 J6.4), P (DD1_P8.13), P (DD1_P7.13), P (DD1_P6.13), P (DD1_P5.13), P (DD1_P4.13), P (DD1_P3.13), P (DD1_P2.13), P (DD1_P1.13)
RST: Switch Matrix (DD2.10 DD3.10 J6.1), P (DD1_P8.10), P (DD1_P7.10), P (DD1_P6.10), P (DD1_P5.10), P (DD1_P4.10), P (DD1_P3.10), P (DD1_P2.10), P (DD1_P1.10)
SHCP: Switch Matrix (DD2.11 DD3.11 J6.2), P (DD1_P8.11), P (DD1_P7.11), P (DD1_P6.11), P (DD1_P5.11), P (DD1_P4.11), P (DD1_P3.11), P (DD1_P2.11), P (DD1_P1.11)
STCP: Switch Matrix (DD2.12 DD3.12 J6.3), P (DD1_P8.12), P (DD1_P7.12), P (DD1_P6.12), P (DD1_P5.12), P (DD1_P4.12), P (DD1_P3.12), P (DD1_P2.12), P (DD1_P1.12)
V: Switch Matrix (J4.1), P (K7_P8.2), P (K7_P7.2), P (K7_P6.2), P (K7_P5.2), P (K7_P4.2), P (K7_P3.2), P (K7_P2.2), P (K7_P1.2)
VS1: Switch Matrix (J1.2), P (K1_P8.3), P (K1_P7.3), P (K1_P6.3), P (K1_P5.3), P (K1_P4.3), P (K1_P3.3), P (K1_P2.3), P (K1_P1.3)
VS2: Switch Matrix (J2.1), P (K2_P8.3), P (K2_P7.3), P (K2_P6.3), P (K2_P5.3), P (K2_P4.3), P (K2_P3.3), P (K2_P2.3), P (K2_P1.3)
VS3: Switch Matrix (J2.2), P (K3_P8.3), P (K3_P7.3), P (K3_P6.3), P (K3_P5.3), P (K3_P4.3), P (K3_P3.3), P (K3_P2.3), P (K3_P1.3)